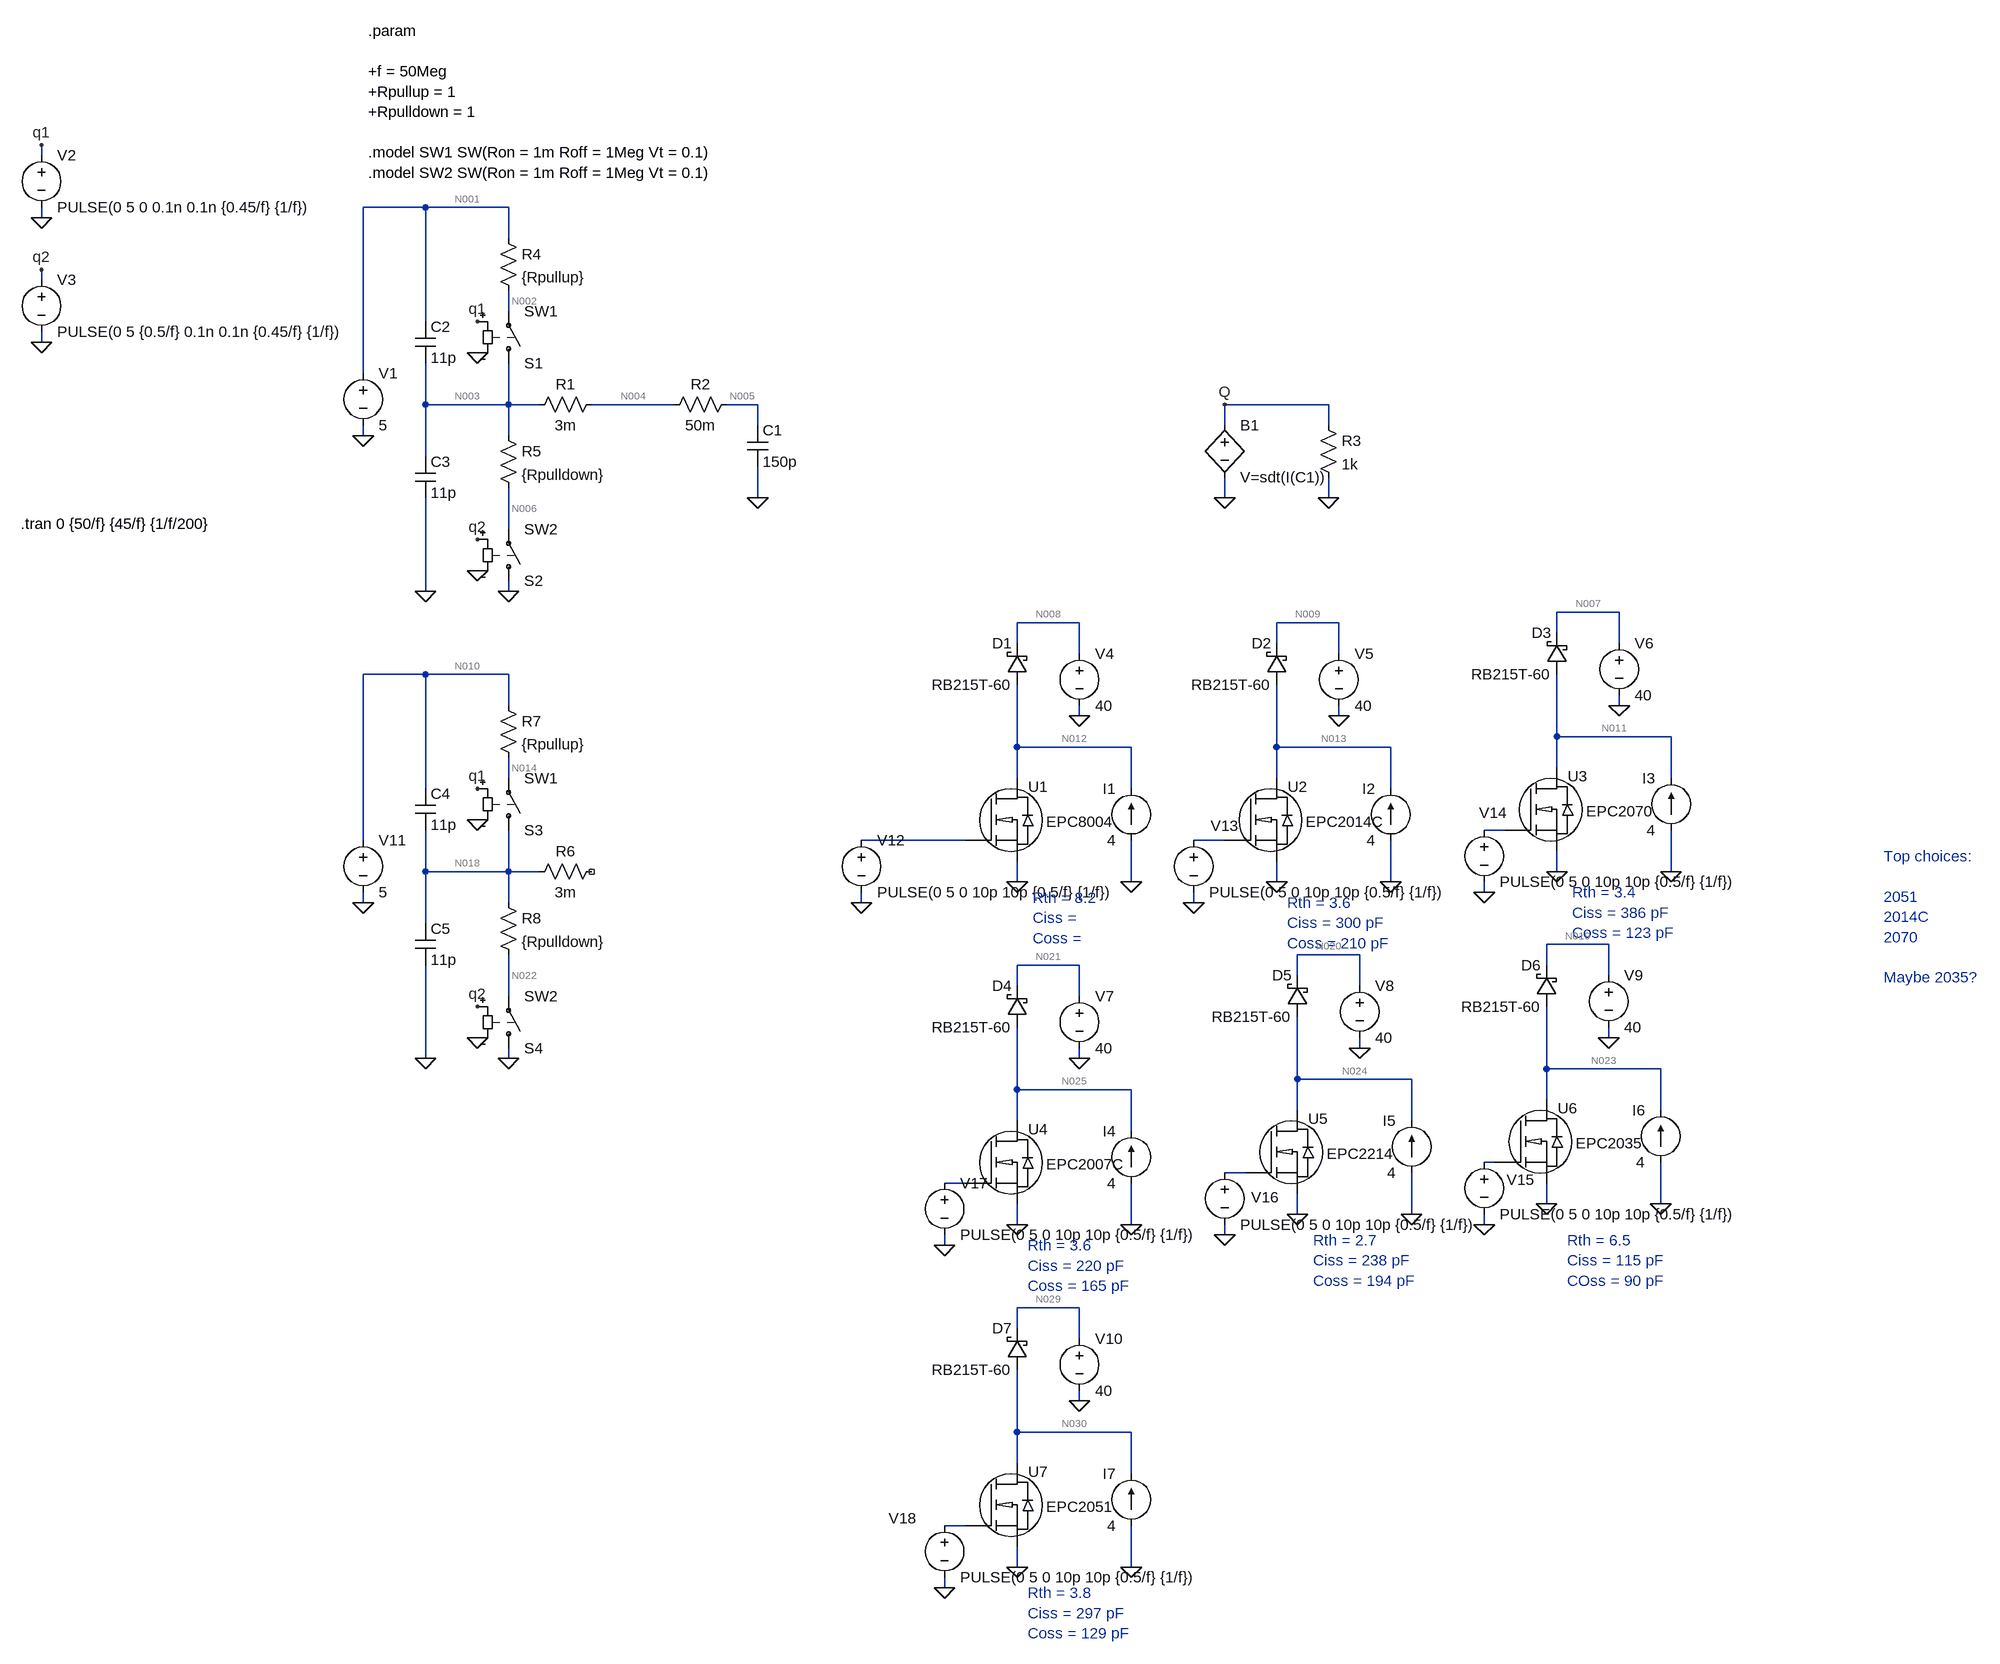
[diagram p0: schematic gatedriver.asc]
gatedriver.asc, the LTspice schematic file:
Version 4
SHEET 1 3348 2128
WIRE -448 -160 -448 -176
WIRE 144 -80 48 -80
WIRE 272 -80 144 -80
WIRE -448 -64 -448 -80
WIRE 272 -32 272 -80
WIRE -448 32 -448 16
WIRE 272 80 272 48
WIRE 144 96 144 -80
WIRE -448 128 -448 112
WIRE 48 176 48 -80
WIRE 144 224 144 160
WIRE 272 224 272 160
WIRE 272 224 144 224
WIRE 320 224 272 224
WIRE 528 224 400 224
WIRE 656 224 608 224
WIRE 1536 224 1376 224
WIRE 656 256 656 224
WIRE 1376 256 1376 224
WIRE 1536 256 1536 224
WIRE 48 272 48 256
WIRE 272 272 272 224
WIRE 144 304 144 224
WIRE 656 368 656 320
WIRE 1376 368 1376 336
WIRE 1536 368 1536 336
WIRE 272 416 272 352
WIRE 144 512 144 368
WIRE 272 512 272 496
WIRE 1984 544 1888 544
WIRE 1152 560 1056 560
WIRE 1552 560 1456 560
WIRE 1888 576 1888 544
WIRE 1056 592 1056 560
WIRE 1456 592 1456 560
WIRE 1984 592 1984 544
WIRE 1152 608 1152 560
WIRE 1552 608 1552 560
WIRE 144 640 48 640
WIRE 272 640 144 640
WIRE 272 688 272 640
WIRE 1984 688 1984 672
WIRE 1152 704 1152 688
WIRE 1552 704 1552 688
WIRE 1888 736 1888 640
WIRE 2064 736 1888 736
WIRE 1056 752 1056 656
WIRE 1232 752 1056 752
WIRE 1456 752 1456 656
WIRE 1632 752 1456 752
WIRE 1888 784 1888 736
WIRE 272 800 272 768
WIRE 1056 800 1056 752
WIRE 1456 800 1456 752
WIRE 2064 800 2064 736
WIRE 144 816 144 640
WIRE 1232 816 1232 752
WIRE 1632 816 1632 752
WIRE 1808 880 1776 880
WIRE 48 896 48 640
WIRE 976 896 816 896
WIRE 1376 896 1328 896
WIRE 144 944 144 880
WIRE 272 944 272 880
WIRE 272 944 144 944
WIRE 320 944 272 944
WIRE 1888 944 1888 912
WIRE 2064 944 2064 880
WIRE 1056 960 1056 928
WIRE 1232 960 1232 896
WIRE 1456 960 1456 928
WIRE 1632 960 1632 896
WIRE 1776 976 1776 960
WIRE 48 992 48 976
WIRE 272 992 272 944
WIRE 816 992 816 976
WIRE 1328 992 1328 976
WIRE 144 1024 144 944
WIRE 1968 1056 1872 1056
WIRE 1584 1072 1488 1072
WIRE 1152 1088 1056 1088
WIRE 1872 1088 1872 1056
WIRE 1488 1104 1488 1072
WIRE 1968 1104 1968 1056
WIRE 1056 1120 1056 1088
WIRE 1584 1120 1584 1072
WIRE 272 1136 272 1072
WIRE 1152 1136 1152 1088
WIRE 1968 1200 1968 1184
WIRE 1584 1216 1584 1200
WIRE 144 1232 144 1088
WIRE 272 1232 272 1216
WIRE 1152 1232 1152 1216
WIRE 1872 1248 1872 1152
WIRE 2048 1248 1872 1248
WIRE 1488 1264 1488 1168
WIRE 1664 1264 1488 1264
WIRE 1056 1280 1056 1184
WIRE 1232 1280 1056 1280
WIRE 1872 1296 1872 1248
WIRE 1488 1312 1488 1264
WIRE 2048 1312 2048 1248
WIRE 1056 1328 1056 1280
WIRE 1664 1328 1664 1264
WIRE 1232 1344 1232 1280
WIRE 1792 1392 1776 1392
WIRE 1408 1408 1376 1408
WIRE 976 1424 944 1424
WIRE 1872 1456 1872 1424
WIRE 2048 1456 2048 1392
WIRE 1488 1472 1488 1440
WIRE 1664 1472 1664 1408
WIRE 1056 1488 1056 1456
WIRE 1232 1488 1232 1424
WIRE 1776 1488 1776 1472
WIRE 1376 1504 1376 1488
WIRE 944 1520 944 1504
WIRE 1152 1616 1056 1616
WIRE 1056 1648 1056 1616
WIRE 1152 1664 1152 1616
WIRE 1152 1760 1152 1744
WIRE 1056 1808 1056 1712
WIRE 1232 1808 1056 1808
WIRE 1056 1856 1056 1808
WIRE 1232 1872 1232 1808
WIRE 976 1952 944 1952
WIRE 1056 2016 1056 1984
WIRE 1232 2016 1232 1952
WIRE 944 2048 944 2032
FLAG 48 272 0
FLAG 656 368 0
FLAG 272 512 0
FLAG 224 480 0
FLAG 224 144 0
FLAG -448 -64 0
FLAG -448 -176 q1
FLAG -448 128 0
FLAG -448 16 q2
FLAG 224 96 q1
FLAG 224 432 q2
FLAG 1376 368 0
FLAG 1536 368 0
FLAG 1376 224 Q
FLAG 144 512 0
FLAG 1056 960 0
FLAG 1232 960 0
FLAG 1152 704 0
FLAG 1456 960 0
FLAG 1632 960 0
FLAG 1552 704 0
FLAG 1888 944 0
FLAG 2064 944 0
FLAG 1984 688 0
FLAG 1056 1488 0
FLAG 1232 1488 0
FLAG 1152 1232 0
FLAG 1488 1472 0
FLAG 1664 1472 0
FLAG 1584 1216 0
FLAG 1872 1456 0
FLAG 2048 1456 0
FLAG 1968 1200 0
FLAG 1056 2016 0
FLAG 1232 2016 0
FLAG 1152 1760 0
FLAG 48 992 0
FLAG 272 1232 0
FLAG 224 1200 0
FLAG 224 864 0
FLAG 224 816 q1
FLAG 224 1152 q2
FLAG 144 1232 0
FLAG 816 992 0
FLAG 1328 992 0
FLAG 1776 976 0
FLAG 1776 1488 0
FLAG 1376 1504 0
FLAG 944 1520 0
FLAG 944 2048 0
SYMBOL voltage 48 160 R0
WINDOW 123 0 0 Left 0
WINDOW 39 0 0 Left 0
SYMATTR InstName V1
SYMATTR Value 5
SYMBOL sw 272 176 M180
SYMATTR InstName S1
SYMATTR Value SW1
SYMBOL sw 272 512 M180
SYMATTR InstName S2
SYMATTR Value SW2
SYMBOL res 624 208 R90
WINDOW 0 0 56 VBottom 2
WINDOW 3 32 56 VTop 2
SYMATTR InstName R2
SYMATTR Value 50m
SYMBOL cap 640 256 R0
SYMATTR InstName C1
SYMATTR Value 150p
SYMBOL voltage -448 -176 R0
WINDOW 123 0 0 Left 0
WINDOW 39 0 0 Left 0
SYMATTR InstName V2
SYMATTR Value PULSE(0 5 0 0.1n 0.1n {0.45/f} {1/f})
SYMBOL voltage -448 16 R0
WINDOW 123 0 0 Left 0
WINDOW 39 0 0 Left 0
SYMATTR InstName V3
SYMATTR Value PULSE(0 5 {0.5/f} 0.1n 0.1n {0.45/f} {1/f})
SYMBOL res 1520 240 R0
SYMATTR InstName R3
SYMATTR Value 1k
SYMBOL bv 1376 240 R0
SYMATTR InstName B1
SYMATTR Value V=sdt(I(C1))
SYMBOL cap 128 96 R0
SYMATTR InstName C2
SYMATTR Value 11p
SYMBOL cap 128 304 R0
SYMATTR InstName C3
SYMATTR Value 11p
SYMBOL res 416 208 R90
WINDOW 0 0 56 VBottom 2
WINDOW 3 32 56 VTop 2
SYMATTR InstName R1
SYMATTR Value 3m
SYMBOL res 256 -48 R0
SYMATTR InstName R4
SYMATTR Value {Rpullup}
SYMBOL res 256 256 R0
SYMATTR InstName R5
SYMATTR Value {Rpulldown}
SYMBOL EPCGaN 976 896 R0
WINDOW 0 97 -83 Left 2
WINDOW 3 125 -29 Left 2
SYMATTR InstName U1
SYMATTR Value EPC8004
SYMBOL current 1232 896 R180
WINDOW 0 24 80 Left 2
WINDOW 3 24 0 Left 2
WINDOW 123 0 0 Left 0
WINDOW 39 0 0 Left 0
SYMATTR InstName I1
SYMATTR Value 4
SYMBOL voltage 1152 592 R0
SYMATTR InstName V4
SYMATTR Value 40
SYMBOL schottky 1072 656 R180
WINDOW 0 24 64 Left 2
WINDOW 3 24 0 Left 2
SYMATTR InstName D1
SYMATTR Value RB215T-60
SYMATTR Description Diode
SYMATTR Type diode
SYMBOL EPCGaN 1376 896 R0
WINDOW 0 97 -83 Left 2
WINDOW 3 125 -29 Left 2
SYMATTR InstName U2
SYMATTR Value EPC2014C
SYMBOL current 1632 896 R180
WINDOW 0 24 80 Left 2
WINDOW 3 24 0 Left 2
WINDOW 123 0 0 Left 0
WINDOW 39 0 0 Left 0
SYMATTR InstName I2
SYMATTR Value 4
SYMBOL voltage 1552 592 R0
SYMATTR InstName V5
SYMATTR Value 40
SYMBOL schottky 1472 656 R180
WINDOW 0 24 64 Left 2
WINDOW 3 24 0 Left 2
SYMATTR InstName D2
SYMATTR Value RB215T-60
SYMATTR Description Diode
SYMATTR Type diode
SYMBOL EPCGaN 1808 880 R0
WINDOW 0 97 -83 Left 2
WINDOW 3 125 -29 Left 2
SYMATTR InstName U3
SYMATTR Value EPC2070
SYMBOL current 2064 880 R180
WINDOW 0 24 80 Left 2
WINDOW 3 24 0 Left 2
WINDOW 123 0 0 Left 0
WINDOW 39 0 0 Left 0
SYMATTR InstName I3
SYMATTR Value 4
SYMBOL voltage 1984 576 R0
SYMATTR InstName V6
SYMATTR Value 40
SYMBOL schottky 1904 640 R180
WINDOW 0 24 64 Left 2
WINDOW 3 24 0 Left 2
SYMATTR InstName D3
SYMATTR Value RB215T-60
SYMATTR Description Diode
SYMATTR Type diode
SYMBOL EPCGaN 976 1424 R0
WINDOW 0 97 -83 Left 2
WINDOW 3 125 -29 Left 2
SYMATTR InstName U4
SYMATTR Value EPC2007C
SYMBOL current 1232 1424 R180
WINDOW 0 24 80 Left 2
WINDOW 3 24 0 Left 2
WINDOW 123 0 0 Left 0
WINDOW 39 0 0 Left 0
SYMATTR InstName I4
SYMATTR Value 4
SYMBOL voltage 1152 1120 R0
SYMATTR InstName V7
SYMATTR Value 40
SYMBOL schottky 1072 1184 R180
WINDOW 0 24 64 Left 2
WINDOW 3 24 0 Left 2
SYMATTR InstName D4
SYMATTR Value RB215T-60
SYMATTR Description Diode
SYMATTR Type diode
SYMBOL EPCGaN 1408 1408 R0
WINDOW 0 97 -83 Left 2
WINDOW 3 125 -29 Left 2
SYMATTR InstName U5
SYMATTR Value EPC2214
SYMBOL current 1664 1408 R180
WINDOW 0 24 80 Left 2
WINDOW 3 24 0 Left 2
WINDOW 123 0 0 Left 0
WINDOW 39 0 0 Left 0
SYMATTR InstName I5
SYMATTR Value 4
SYMBOL voltage 1584 1104 R0
SYMATTR InstName V8
SYMATTR Value 40
SYMBOL schottky 1504 1168 R180
WINDOW 0 24 64 Left 2
WINDOW 3 24 0 Left 2
SYMATTR InstName D5
SYMATTR Value RB215T-60
SYMATTR Description Diode
SYMATTR Type diode
SYMBOL EPCGaN 1792 1392 R0
WINDOW 0 97 -83 Left 2
WINDOW 3 125 -29 Left 2
SYMATTR InstName U6
SYMATTR Value EPC2035
SYMBOL current 2048 1392 R180
WINDOW 0 24 80 Left 2
WINDOW 3 24 0 Left 2
WINDOW 123 0 0 Left 0
WINDOW 39 0 0 Left 0
SYMATTR InstName I6
SYMATTR Value 4
SYMBOL voltage 1968 1088 R0
SYMATTR InstName V9
SYMATTR Value 40
SYMBOL schottky 1888 1152 R180
WINDOW 0 24 64 Left 2
WINDOW 3 24 0 Left 2
SYMATTR InstName D6
SYMATTR Value RB215T-60
SYMATTR Description Diode
SYMATTR Type diode
SYMBOL EPCGaN 976 1952 R0
WINDOW 0 97 -83 Left 2
WINDOW 3 125 -29 Left 2
SYMATTR InstName U7
SYMATTR Value EPC2051
SYMBOL current 1232 1952 R180
WINDOW 0 24 80 Left 2
WINDOW 3 24 0 Left 2
WINDOW 123 0 0 Left 0
WINDOW 39 0 0 Left 0
SYMATTR InstName I7
SYMATTR Value 4
SYMBOL voltage 1152 1648 R0
SYMATTR InstName V10
SYMATTR Value 40
SYMBOL schottky 1072 1712 R180
WINDOW 0 24 64 Left 2
WINDOW 3 24 0 Left 2
SYMATTR InstName D7
SYMATTR Value RB215T-60
SYMATTR Description Diode
SYMATTR Type diode
SYMBOL voltage 48 880 R0
WINDOW 123 0 0 Left 0
WINDOW 39 0 0 Left 0
SYMATTR InstName V11
SYMATTR Value 5
SYMBOL sw 272 896 M180
SYMATTR InstName S3
SYMATTR Value SW1
SYMBOL sw 272 1232 M180
SYMATTR InstName S4
SYMATTR Value SW2
SYMBOL cap 128 816 R0
SYMATTR InstName C4
SYMATTR Value 11p
SYMBOL cap 128 1024 R0
SYMATTR InstName C5
SYMATTR Value 11p
SYMBOL res 416 928 R90
WINDOW 0 0 56 VBottom 2
WINDOW 3 32 56 VTop 2
SYMATTR InstName R6
SYMATTR Value 3m
SYMBOL res 256 672 R0
SYMATTR InstName R7
SYMATTR Value {Rpullup}
SYMBOL res 256 976 R0
SYMATTR InstName R8
SYMATTR Value {Rpulldown}
SYMBOL voltage 816 880 R0
WINDOW 123 0 0 Left 0
WINDOW 39 0 0 Left 0
SYMATTR InstName V12
SYMATTR Value PULSE(0 5 0 10p 10p {0.5/f} {1/f})
SYMBOL voltage 1328 880 R0
WINDOW 0 26 -7 Left 2
WINDOW 123 0 0 Left 0
WINDOW 39 0 0 Left 0
SYMATTR InstName V13
SYMATTR Value PULSE(0 5 0 10p 10p {0.5/f} {1/f})
SYMBOL voltage 1776 864 R0
WINDOW 0 -8 -11 Left 2
WINDOW 123 0 0 Left 0
WINDOW 39 0 0 Left 0
SYMATTR InstName V14
SYMATTR Value PULSE(0 5 0 10p 10p {0.5/f} {1/f})
SYMBOL voltage 1776 1376 R0
WINDOW 0 35 43 Left 2
WINDOW 123 0 0 Left 0
WINDOW 39 0 0 Left 0
SYMATTR InstName V15
SYMATTR Value PULSE(0 5 0 10p 10p {0.5/f} {1/f})
SYMBOL voltage 1376 1392 R0
WINDOW 0 41 54 Left 2
WINDOW 123 0 0 Left 0
WINDOW 39 0 0 Left 0
SYMATTR InstName V16
SYMATTR Value PULSE(0 5 0 10p 10p {0.5/f} {1/f})
SYMBOL voltage 944 1408 R0
WINDOW 123 0 0 Left 0
WINDOW 39 0 0 Left 0
SYMATTR InstName V17
SYMATTR Value PULSE(0 5 0 10p 10p {0.5/f} {1/f})
SYMBOL voltage 944 1936 R0
WINDOW 0 -86 5 Left 2
WINDOW 123 0 0 Left 0
WINDOW 39 0 0 Left 0
SYMATTR InstName V18
SYMATTR Value PULSE(0 5 0 10p 10p {0.5/f} {1/f})
TEXT 56 -352 Left 2 !.param\n \n+f = 50Meg\n+Rpullup = 1\n+Rpulldown = 1\n \n.model SW1 SW(Ron = 1m Roff = 1Meg Vt = 0.1)\n.model SW2 SW(Ron = 1m Roff = 1Meg Vt = 0.1)
TEXT -480 408 Left 2 !.tran 0 {50/f} {45/f} {1/f/200}
TEXT 1080 984 Left 2 ;Rth = 8.2\nCiss = \nCoss =
TEXT 1472 992 Left 2 ;Rth = 3.6\nCiss = 300 pF\nCoss = 210 pF
TEXT 1912 976 Left 2 ;Rth = 3.4\nCiss = 386 pF\nCoss = 123 pF
TEXT 1072 1520 Left 2 ;Rth = 3.6\nCiss = 220 pF\nCoss = 165 pF
TEXT 1512 1512 Left 2 ;Rth = 2.7\nCiss = 238 pF\nCoss = 194 pF
TEXT 1904 1512 Left 2 ;Rth = 6.5\nCiss = 115 pF\nCOss = 90 pF
TEXT 1072 2056 Left 2 ;Rth = 3.8\nCiss = 297 pF\nCoss = 129 pF
TEXT 2392 920 Left 2 ;Top choices:\n \n2051\n2014C\n2070\n \nMaybe 2035?

The netlist it stands for:
* gatedriver.asc
V1 N001 0 5
S1 N003 N002 q1 0 SW1
S2 0 N006 q2 0 SW2
R2 N005 N004 50m
C1 N005 0 150p
V2 q1 0 PULSE(0 5 0 0.1n 0.1n {0.45/f} {1/f})
V3 q2 0 PULSE(0 5 {0.5/f} 0.1n 0.1n {0.45/f} {1/f})
R3 Q 0 1k
B1 Q 0 V=sdt(I(C1))
C2 N001 N003 11p
C3 N003 0 11p
R1 N004 N003 3m
R4 N001 N002 {Rpullup}
R5 N003 N006 {Rpulldown}
XU1 N016 N012 0 EPC8004  ; pins gatein drainin N_0
I1 0 N012 4
V4 N008 0 40
D1 N012 N008 RB215T-60
XU2 N017 N013 0 EPC2014C  ; pins gatein drainin N_0
I2 0 N013 4
V5 N009 0 40
D2 N013 N009 RB215T-60
XU3 N015 N011 0 EPC2070  ; pins gatein drainin N_0
I3 0 N011 4
V6 N007 0 40
D3 N011 N007 RB215T-60
XU4 N028 N025 0 EPC2007C  ; pins gatein drainin N_0
I4 0 N025 4
V7 N021 0 40
D4 N025 N021 RB215T-60
XU5 N027 N024 0 EPC2214  ; pins gatein drainin N_0
I5 0 N024 4
V8 N020 0 40
D5 N024 N020 RB215T-60
XU6 N026 N023 0 EPC2035  ; pins gatein drainin N_0
I6 0 N023 4
V9 N019 0 40
D6 N023 N019 RB215T-60
XU7 N031 N030 0 EPC2051  ; pins gatein drainin N_0
I7 0 N030 4
V10 N029 0 40
D7 N030 N029 RB215T-60
V11 N010 0 5
S3 N018 N014 q1 0 SW1
S4 0 N022 q2 0 SW2
C4 N010 N018 11p
C5 N018 0 11p
R6 NC_01 N018 3m
R7 N010 N014 {Rpullup}
R8 N018 N022 {Rpulldown}
V12 N016 0 PULSE(0 5 0 10p 10p {0.5/f} {1/f})
V13 N017 0 PULSE(0 5 0 10p 10p {0.5/f} {1/f})
V14 N015 0 PULSE(0 5 0 10p 10p {0.5/f} {1/f})
V15 N026 0 PULSE(0 5 0 10p 10p {0.5/f} {1/f})
V16 N027 0 PULSE(0 5 0 10p 10p {0.5/f} {1/f})
V17 N028 0 PULSE(0 5 0 10p 10p {0.5/f} {1/f})
V18 N031 0 PULSE(0 5 0 10p 10p {0.5/f} {1/f})
.model D D
.lib standard.dio
.param
+f = 50Meg
+Rpullup = 1
+Rpulldown = 1
.model SW1 SW(Ron = 1m Roff = 1Meg Vt = 0.1)
.model SW2 SW(Ron = 1m Roff = 1Meg Vt = 0.1)
.tran 0 {50/f} {45/f} {1/f/200}
* Rth = 8.2
* Ciss =
* Coss =
* Rth = 3.6
* Ciss = 300 pF
* Coss = 210 pF
* Rth = 3.4
* Ciss = 386 pF
* Coss = 123 pF
* Rth = 3.6
* Ciss = 220 pF
* Coss = 165 pF
* Rth = 2.7
* Ciss = 238 pF
* Coss = 194 pF
* Rth = 6.5
* Ciss = 115 pF
* COss = 90 pF
* Rth = 3.8
* Ciss = 297 pF
* Coss = 129 pF
* Top choices:
* 2051
* 2014C
* 2070
* Maybe 2035?
.lib EPCGanlibrary.lib
.backanno
.end

* Results of the author's LTspice run, read from the files saved beside the schematic
* Operating Point, zero values left out:
*   V(n001) = 5 V
*   V(n003) = 2.5 V
*   V(n002) = 5 V
*   V(n006) = 2.5 V
*   V(n005) = 2.5 V
*   V(n004) = 2.5 V
*   V(n012) = 40.44 V
*   V(n008) = 40 V
*   V(n013) = 40.44 V
*   V(n009) = 40 V
*   V(n011) = 40.44 V
*   V(n007) = 40 V
*   V(n025) = 40.44 V
*   V(n021) = 40 V
*   V(n024) = 40.44 V
*   V(n020) = 40 V
*   V(n023) = 40.44 V
*   V(n019) = 40 V
*   V(n030) = 40.44 V
*   V(n029) = 40 V
*   V(n010) = 5 V
*   V(n018) = 2.5 V
*   V(n014) = 5 V
*   V(n022) = 2.5 V
*   I(D7) = 4 A
*   I(D6) = 4 A
*   I(D5) = 4 A
*   I(D4) = 4 A
*   I(D3) = 4 A
*   I(D2) = 4 A
*   I(D1) = 4 A
*   I(I7) = 4 A
*   I(I6) = 4 A
*   I(I5) = 4 A
*   I(I4) = 4 A
*   I(I3) = 4 A
*   I(I2) = 4 A
*   I(I1) = 4 A
*   I(R8) = 2.5 µA
*   I(R7) = 2.5 µA
*   I(R5) = 2.5 µA
*   I(R4) = 2.5 µA
*   I(S4) = 2.5 µA
*   I(S2) = 2.5 µA
*   I(S3) = 2.5 µA
*   I(S1) = 2.5 µA
*   I(V18) = 114.9 nA
*   I(V17) = 160.7 nA
*   I(V16) = 143.6 nA
*   I(V15) = 96.04 nA
*   I(V14) = 103.6 nA
*   I(V13) = 232.6 nA
*   I(V12) = 40.67 nA
*   I(V11) = -2.5 µA
*   I(V10) = 4 A
*   I(V9) = 4 A
*   I(V8) = 4 A
*   I(V7) = 4 A
*   I(V6) = 4 A
*   I(V5) = 4 A
*   I(V4) = 4 A
*   I(V1) = -2.5 µA
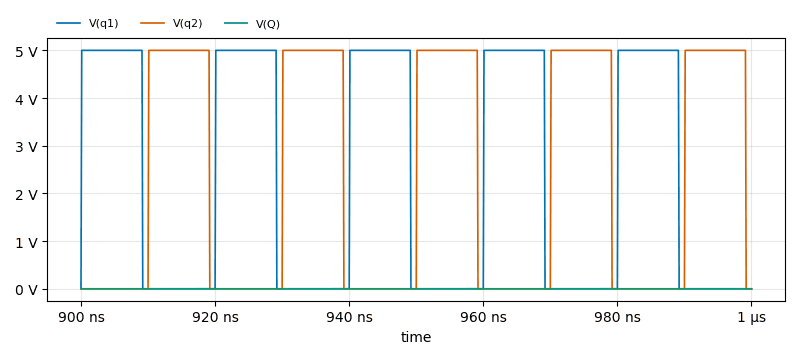
[diagram p1: Transient Analysis of gatedriver.asc, plotted from the saved traces]
* Transient Analysis, 1 run:
*   V(q1): min 0 V, max 5 V, average 2.275 V, rms 3.367 V, last 0 V
*   V(q2): min 0 V, max 5 V, average 2.275 V, rms 3.367 V, last 0 V
*   V(Q): min -375.1 pV, max 374.9 pV, average -50.73 fV, rms 367.6 pV, last -375.1 pV